# EAGLE design capslocker (EAGLE 6.1)
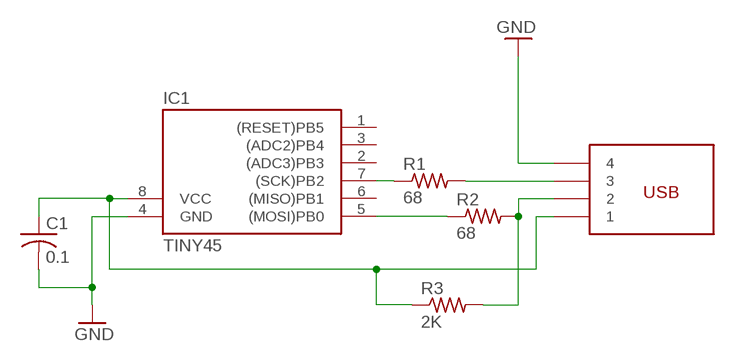
[diagram p0: schematic, sheet 1]

## Parts
C1  0.1  C-USC0805  [C0805]
IC1  TINY45  [SOIC8]
R1  68  R-US_R0603  [R0603]
R2  68  R-US_R0603  [R0603]
R3  2K  R-US_R0603  [R0603]
U$1  USB_A_EDGE  [USB_A_EDGE]

## Nets
GND: C1.2 IC1.4(GND) U$1.P$3
N$1: C1.1 IC1.8(VCC) R3.1 U$1.P$4
N$2: R1.2 U$1.P$1
N$3: R2.2 R3.2 U$1.P$2
N$4: IC1.7((SCK)PB2) R1.1
N$5: IC1.5((MOSI)PB0) R2.1
Unconnected: IC1.1((RESET)PB5) IC1.2((ADC3)PB3) IC1.3((ADC2)PB4) IC1.6((MISO)PB1)

## Library data of the parts
C1 = rcl:C-US: CAPACITOR, American symbol
IC1 = avr-4:TINY45: ATTiny45 8-lead SOIC8
R1-R3 = rcl:R-US_: RESISTOR, American symbol
U$1 = macetech:USB_A_EDGE

## Board
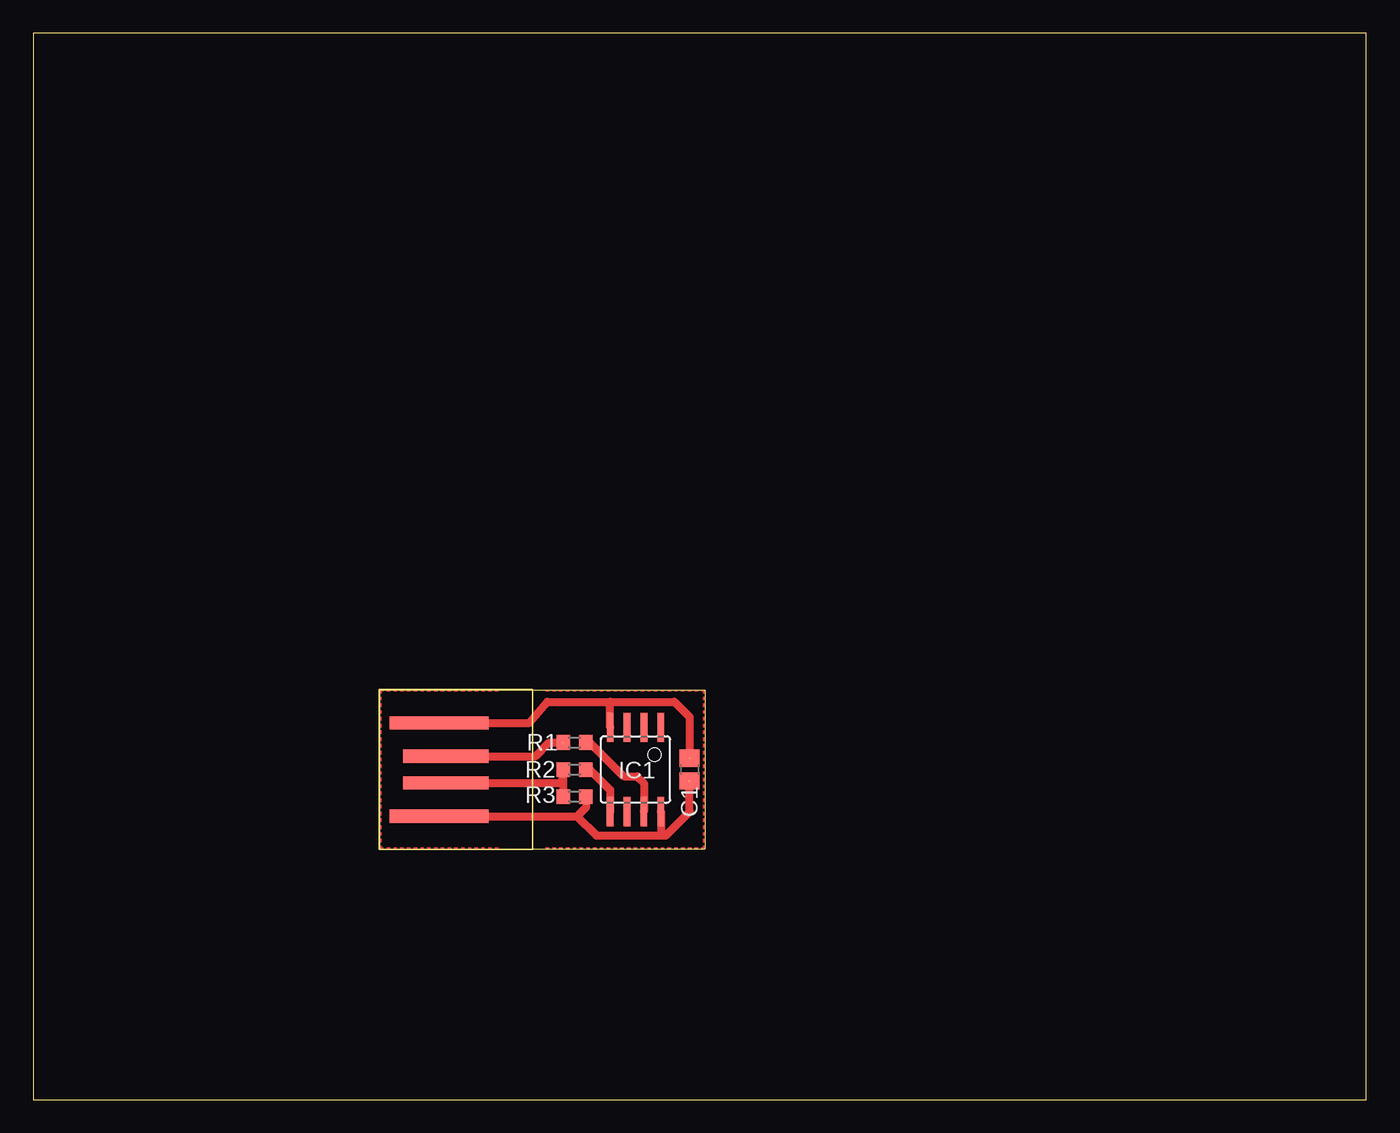
[diagram p1: board, top side]

Size 100 x 80 mm. Coordinates in mm from the lower left corner, seen from the top.
Outline: 0,0 100,0 100,80 0,80 0,0
Outline: 50.38,30.73 50.38,18.79 26,18.79 26,30.73 50.38,30.73
Copper layers (1*16): Top 0.035mm / dielectric 1.5mm / Bottom 0.035mm
Design rules: minimum track width 10mil, minimum drill 24mil, track to track 8mil, track to pad 8mil, pad to pad 8mil, via to via 8mil, smd to smd 8mil, copper to edge 40mil, drill to drill 8mil, minimum pad ring 10mil, minimum via ring 8mil, stop-mask expansion 4mil, vias tented up to drill 0mil, thermal gap 10mil

### Footprints (pad centres in the part's own frame; a part is rotated, then mirrored left to right if it is on the bottom)
C0805 = smd 1.3 x 1.5: 1 -0.85,0; 2 0.85,0
SOIC8 = smd 0.5 x 2.2: 1 -1.905,-3.154; 2 -0.645,-3.154; 3 0.625,-3.154; 4 1.895,-3.154; 5 1.905,3.154; 6 0.635,3.154; 7 -0.635,3.154; 8 -1.905,3.154
R0603 = smd 1 x 1.1: 1 -0.85,0; 2 0.85,0
USB_A_EDGE = smd 6.41 x 1: P$1 0,1; P$2 0,-1 | smd 7.41 x 1: P$3 -0.5,3.5; P$4 -0.5,-3.5

### Placement (x,y rotation side)
C1  49.24,24.76 90 top
IC1  45.17,24.76 180 top
R1  40.6,26.79 180 top
R2  40.6,24.76 180 top
R3  40.6,22.73 180 top
U$1  30.95,24.76 0 top

### Tracks (layer width: path | path; a pad name or v marks a point on that pad's centre or on a via)
GND  (1 unrouted)
  Top 0.406: 43.27,27.93 arc45 IC1.4
  Top 0.61: U$1.P$3 37.24,28.26 38.57,29.84 43.27,29.84 | 43.27,29.84 48.09,29.84 49.24,28.7 49.24,25.65 | 43.27,27.93 43.27,29.84
N$1  (1 unrouted)
  Top 0.61: U$1.P$4 40.8,21.26 | 40.8,21.26 42.25,19.81 47.08,19.81 | 47.08,19.81 47.46,19.81 49.24,21.58 49.24,23.87 | R3.1 41.45,21.91 40.8,21.26 | IC1.8 47.08,19.81
N$2  (1 unrouted)
  Top 0.61: U$1.P$1 37.66,25.76 38.7,26.79 39.71,26.79
N$3
  Top 0.61: U$1.P$2 33.74,23.76 | 33.74,23.76 34,23.76 | 33.74,23.76 33.74,23.74 39.71,23.74 39.71,24.72 R2.2 R3.2
N$4
  Top 0.406: 45.81,21.58 IC1.7
  Top 0.61: R1.1 41.74,26.79 44.28,24.25 45.3,24.25 45.81,23.74 IC1.7
N$5
  Top 0.406: 43.27,21.58 IC1.5
  Top 0.61: R2.1 41.74,24.76 43.27,23.24 IC1.5
(copper drawn outside any net)
  shapes: Top area x132